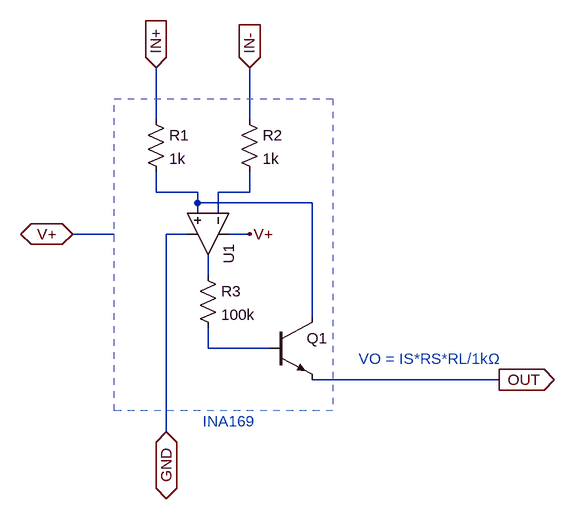
[diagram p0: schematic INA169.asc]
INA169.asc, the LTspice schematic file:
Version 4
SHEET 1 880 680
WIRE -64 -80 -64 -160
WIRE 80 -80 80 -160
WIRE -64 32 -64 0
WIRE 0 32 -64 32
WIRE 80 32 80 0
WIRE 80 32 32 32
WIRE 0 48 0 32
WIRE 176 48 0 48
WIRE 0 64 0 48
WIRE 32 64 32 32
WIRE -128 96 -192 96
WIRE -16 96 -48 96
WIRE 80 96 48 96
WIRE 16 160 16 128
WIRE 176 224 176 48
WIRE 16 272 16 240
WIRE 112 272 16 272
WIRE 464 320 176 320
WIRE -48 400 -48 96
FLAG -48 400 GND
IOPIN -48 400 BiDir
FLAG 464 320 OUT
IOPIN 464 320 Out
FLAG -64 -160 IN+
IOPIN -64 -160 In
FLAG 80 -160 IN-
IOPIN 80 -160 In
FLAG 80 96 V+
FLAG -192 96 V+
IOPIN -192 96 BiDir
SYMBOL OpAmps\\UniversalOpAmp2 16 96 R90
SYMATTR InstName U1
SYMATTR Value2 Avol=10Meg GBW=10Meg Slew=100Meg
SYMBOL res -80 -96 R0
SYMATTR InstName R1
SYMATTR Value 1k
SYMBOL res 64 -96 R0
SYMATTR InstName R2
SYMATTR Value 1k
SYMBOL npn 112 224 R0
WINDOW 3 56 68 Invisible 2
SYMATTR Value BC548C
SYMATTR InstName Q1
SYMBOL res 0 144 R0
SYMATTR InstName R3
SYMATTR Value 100k
TEXT 248 288 Left 2 ;VO = IS*RS*RL/1kΩ
TEXT 8 384 Left 2 ;INA169
RECTANGLE Normal 208 368 -128 -112 2

The netlist it stands for:
* INA169.asc
XU1 N001 N002 V+ GND N003 level2 Avol=10Meg GBW=10Meg Slew=100Meg Ilimit=25m Rail=0 Vos=0 En=0 Enk=0 In=0 Ink=0 Rin=500Meg  ; pins In+ In- V+ V- OUT
R1 IN+ N001 1k
R2 IN- N002 1k
Q1 N001 N004 OUT 0 BC548C
R3 N003 N004 100k
.model NPN NPN
.model PNP PNP
.lib standard.bjt
* VO = IS*RS*RL/1kΩ
* INA169
.lib UniversalOpAmp2.lib
.backanno
.end